# EAGLE design CNC-MainStepInterface-panel (EAGLE 6.4)
CNC Control Panel - Main + Stepper + Interface Version 1.0 (20121119) Acts as the brain for the whole system Connects to other boards via "slots" in the form of JBUS connectors which carry SPI, system clock and one interrupt line Runs the upload interface via serial to USB-CDC-ACM adapter plugged into console port One dedicated MCU per axis running all the physics for each movement Also reads the limit switches Can do linear or circular movement Can buffer the next move while the current one is executing Can halt movement in progress Passthrough topology (external LPT master support) Crossbar switch using buffers MCU as crossbar switch controller Charge pump detection/generation E-Stop detection LED control for current master UI
Assembly variants: ProMini, 20MHz
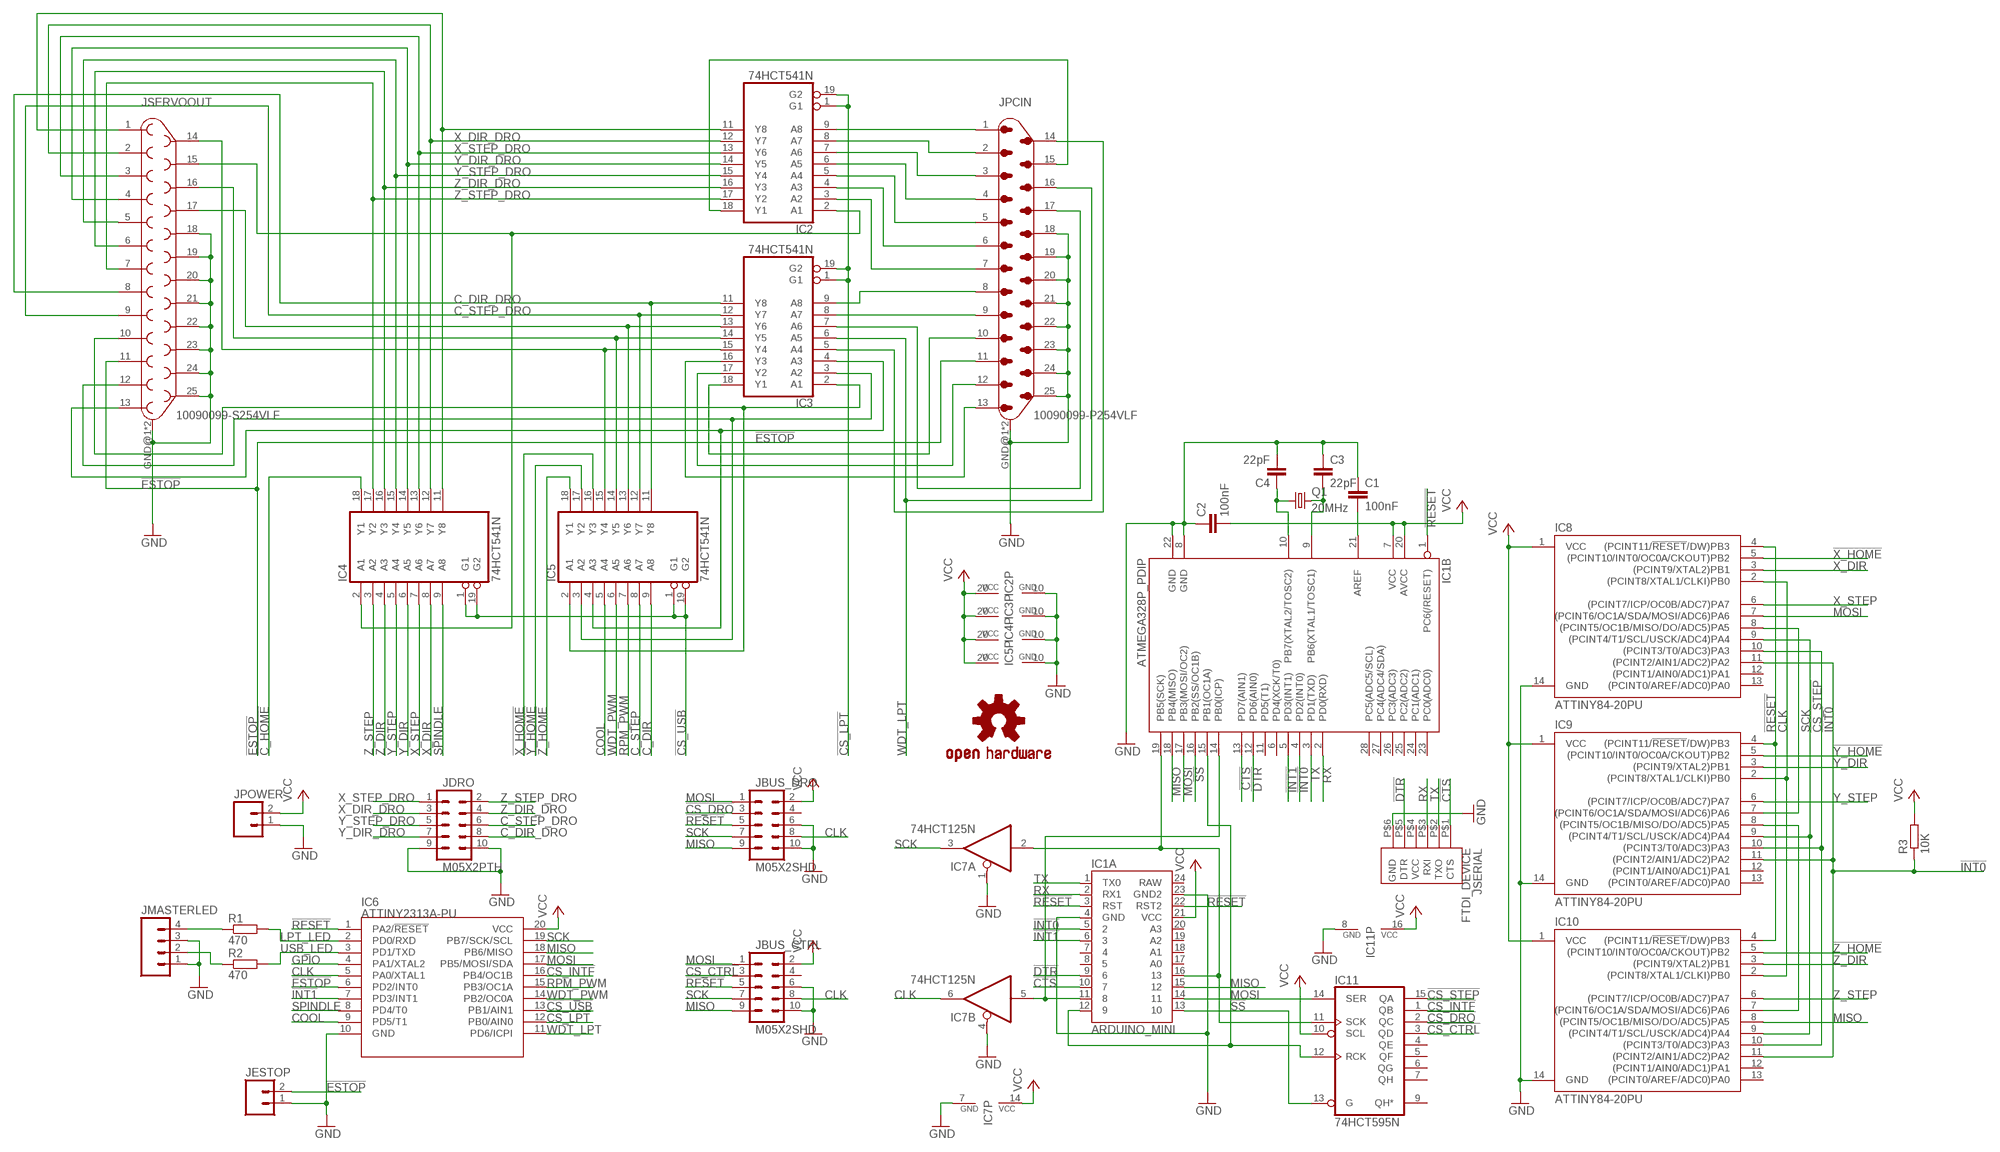
[diagram p0: schematic, sheet 1]

## Parts
C1  100nF  C-EU050-025X075  [C050-025X075]  (not fitted in variant ProMini)
C2  100nF  C-EU050-025X075  [C050-025X075]  (not fitted in variant ProMini)
C3  22pF  C-EU050-025X075  [C050-025X075]  (not fitted in variant ProMini)
C4  22pF  C-EU050-025X075  [C050-025X075]  (not fitted in variant ProMini)
IC1A  ARDUINO_MINI  [ARDUINO_MINI]  (not fitted in variant 20MHz)
IC1B  ATMEGA328P_PDIP  [DIL28-3]  (not fitted in variant ProMini)
IC2  74HCT541N  [DIL20]
IC3  74HCT541N  [DIL20]
IC4  74HCT541N  [DIL20]
IC5  74HCT541N  [DIL20]
IC6  ATTINY2313A-PU  [DIL20]
IC7  74HCT125N  [DIL14]
IC8  ATTINY84-20PU  [DIL14]
IC9  ATTINY84-20PU  [DIL14]
IC10  ATTINY84-20PU  [DIL14]
IC11  74HCT595N  [DIL16]
JBUS_CTRL  M05X2SHD  [2X5-SHROUDED]
JBUS_DRO  M05X2SHD  [2X5-SHROUDED]
JDRO  M05X2PTH  [AVR_ICSP]
JESTOP  M02PTH  [1X02]
JMASTERLED  M04PTH  [1X04]
JPCIN  10090099-P254VLF  [10090099-P254VLF]
JPOWER  M02POLAR  [MOLEX-1X2]
JSERIAL  FTDI_DEVICE  [FTDI_DEVICE_SIDE]
JSERVOOUT  10090099-S254VLF  [10090099-S254VLF]
Q1  20MHz  CRYSTALHC49U-V  [HC49U-V]  (not fitted in variant ProMini)
R1  470  R-EU_0207/10  [0207/10]
R2  470  R-EU_0207/10  [0207/10]
R3  10K  R-EU_0207/10  [0207/10]
U$1  SPARKFUN_OSHW-LOGOL  [SPARKFUN_OSHW-LOGO-L]

## Nets
!C_HOME: IC4.18(Y1)
!CS_CTRL: IC11.3(QD) JBUS_CTRL.3
!CS_DRO: IC11.2(QC) JBUS_DRO.3
!CS_INTF: IC6.16(PB4/OC1B) IC11.1(QB)
!CS_LPT: IC2.1(G1) IC2.19(G2) IC3.1(G1) IC3.19(G2) IC6.12(PB0/AIN0)
!CS_STEP: IC8.10((PCINT3/T0/ADC3)PA3) IC9.10((PCINT3/T0/ADC3)PA3) IC10.10((PCINT3/T0/ADC3)PA3) IC11.15(QA)
!CS_USB: IC4.1(G1) IC4.19(G2) IC5.1(G1) IC5.19(G2) IC6.13(PB1/AIN1)
!CTS: IC1A.10 IC1B.13(PD7(AIN1)) JSERIAL.P$1(CTS)
!DTR: IC1A.9 IC1B.12(PD6(AIN0)) JSERIAL.P$5(DTR)
!ESTOP: IC6.6(PD2/INT0) JESTOP.2 JPCIN.11 JSERVOOUT.11
!INT0: IC1A.5 IC1B.4(PD2(INT0)) IC8.11((PCINT2/AIN1/ADC2)PA2) IC9.11((PCINT2/AIN1/ADC2)PA2) IC10.11((PCINT2/AIN1/ADC2)PA2) R3.1
!INT1: IC1A.6 IC1B.5(PD3(INT1)) IC6.7(PD3/INT1)
!RESET: IC1A.3(RST) IC1A.22(RST2) IC1B.1(PC6(/RESET)) IC6.1(PA2/!RESET) IC8.4((PCINT11/!RESET!/DW)PB3) IC9.4((PCINT11/!RESET!/DW)PB3) IC10.4((PCINT11/!RESET!/DW)PB3) JBUS_CTRL.5 JBUS_DRO.5
!SS: IC1A.13 IC1B.16(PB2(SS/OC1B)) IC11.13(G)
!X_HOME: IC5.16(Y3) IC8.5((PCINT10/INT0/OC0A/CKOUT)PB2)
!Y_HOME: IC5.17(Y2) IC9.5((PCINT10/INT0/OC0A/CKOUT)PB2)
!Z_HOME: IC5.18(Y1) IC10.5((PCINT10/INT0/OC0A/CKOUT)PB2)
C_DIR: IC5.9(A8)
C_DIR_DRO: IC3.11(Y8) IC5.11(Y8) JDRO.8 JSERVOOUT.8
C_STEP: IC5.8(A7)
C_STEP_DRO: IC3.12(Y7) IC5.12(Y7) JDRO.6 JSERVOOUT.9
CLK: IC6.5(PA0/XTAL1) IC7.6(B:O) IC8.2((PCINT8/XTAL1/CLKI)PB0) IC9.2((PCINT8/XTAL1/CLKI)PB0) IC10.2((PCINT8/XTAL1/CLKI)PB0) JBUS_CTRL.8 JBUS_DRO.8
CLK_INT: IC1A.11 IC1B.14(PB0(ICP)) IC7.5(B:I)
COOL: IC5.5(A4) IC6.9(PD5/T1)
GND: C1.1 C2.1 C3.1 C4.2 IC1A.4(GND) IC1A.23(GND2) IC1B.8(GND) IC1B.22(GND) IC2.10(GND) IC3.10(GND) IC4.10(GND) IC5.10(GND) IC6.10(GND) IC7.1(A:OE) IC7.4(B:OE) IC7.7(P:GND) IC8.14(GND) IC9.14(GND) IC10.14(GND) IC11.8(GND) JBUS_CTRL.6 JBUS_CTRL.10 JBUS_DRO.6 JBUS_DRO.10 JDRO.9 JDRO.10 JESTOP.1 JMASTERLED.1 JMASTERLED.3 JPCIN.18 JPCIN.19 JPCIN.20 JPCIN.21 JPCIN.22 JPCIN.23 JPCIN.24 JPCIN.25 JPCIN.GND@1(GND) JPCIN.GND@2(GND) JPOWER.1 JSERIAL.P$6(GND) JSERVOOUT.18 JSERVOOUT.19 JSERVOOUT.20 JSERVOOUT.21 JSERVOOUT.22 JSERVOOUT.23 JSERVOOUT.24 JSERVOOUT.25 JSERVOOUT.GND@1(GND) JSERVOOUT.GND@2(GND)
GPIO: IC6.4(PA1/XTAL2)
LPT_LED: IC6.2(PD0/RXD) R1.2
MISO: IC1A.15 IC1B.18(PB4(MISO)) IC6.18(PB6/MISO) IC10.8((PCINT5/OC1B/MISO/DO/ADC5)PA5) JBUS_CTRL.9 JBUS_DRO.9
MISO_1: IC8.8((PCINT5/OC1B/MISO/DO/ADC5)PA5) IC9.7((PCINT6/OC1A/SDA/MOSI/ADC6)PA6)
MISO_2: IC9.8((PCINT5/OC1B/MISO/DO/ADC5)PA5) IC10.7((PCINT6/OC1A/SDA/MOSI/ADC6)PA6)
MOSI: IC1A.14 IC1B.17(PB3(MOSI/OC2)) IC6.17(PB5/MOSI/SDA) IC8.7((PCINT6/OC1A/SDA/MOSI/ADC6)PA6) IC11.14(SER) JBUS_CTRL.1 JBUS_DRO.1
N$1: IC2.9(A8) JPCIN.1
N$2: IC2.8(A7) JPCIN.2
N$3: IC2.7(A6) JPCIN.3
N$4: IC2.6(A5) JPCIN.4
N$5: IC2.5(A4) JPCIN.5
N$6: IC2.4(A3) JPCIN.6
N$7: IC2.3(A2) JPCIN.7
N$8: IC3.9(A8) JPCIN.8
N$9: IC3.8(A7) JPCIN.9
N$10: IC3.5(A4) JPCIN.14
N$11: JMASTERLED.2 R2.1
N$12: IC3.2(A1) IC5.2(A1) JSERVOOUT.10
N$13: IC3.3(A2) IC5.3(A2) JSERVOOUT.12
N$14: IC3.7(A6) JPCIN.17
N$15: IC3.4(A3) IC5.4(A3) JSERVOOUT.13
N$16: JMASTERLED.4 R1.1
N$17: IC3.16(Y3) JPCIN.13
N$18: IC3.17(Y2) JPCIN.12
N$19: IC2.18(Y1) JPCIN.15
N$20: C1.2 IC1B.21(AREF)
N$21: IC3.18(Y1) JPCIN.10
N$22: IC3.15(Y4) IC5.15(Y4) JSERVOOUT.14
N$23: IC3.14(Y5) IC5.14(Y5) JSERVOOUT.16
N$24: IC3.13(Y6) IC5.13(Y6) JSERVOOUT.17
N$34: IC2.2(A1) IC4.2(A1) JSERVOOUT.15
N$38: IC2.11(Y8) IC4.11(Y8) JSERVOOUT.1
RPM_PWM: IC5.7(A6) IC6.15(PB3/OC1A)
RX: IC1A.2(RX1) IC1B.2(PD0(RXD)) JSERIAL.P$3(RXI)
SADDR: IC1A.12 IC1B.15(PB1(OC1A)) IC11.12(RCK)
SCK: IC6.19(PB7/SCK/SCL) IC7.3(A:O) IC8.9((PCINT4/T1/SCL/USCK/ADC4)PA4) IC9.9((PCINT4/T1/SCL/USCK/ADC4)PA4) IC10.9((PCINT4/T1/SCL/USCK/ADC4)PA4) JBUS_CTRL.7 JBUS_DRO.7
SCK_INT: IC1A.16 IC1B.19(PB5(SCK)) IC7.2(A:I) IC11.11(SCK)
SPINDLE: IC4.9(A8) IC6.8(PD4/T0)
TX: IC1A.1(TX0) IC1B.3(PD1(TXD)) JSERIAL.P$2(TXO)
USB_LED: IC6.3(PD1/TXD) R2.2
VCC: C2.2 IC1A.21(VCC) IC1B.7(VCC) IC1B.20(AVCC) IC2.20(VCC) IC3.20(VCC) IC4.20(VCC) IC5.20(VCC) IC6.20(VCC) IC7.14(P:VCC) IC8.1(VCC) IC9.1(VCC) IC10.1(VCC) IC11.10(SCL) IC11.16(VCC) JBUS_CTRL.2 JBUS_DRO.2 JPOWER.2 R3.2
WDT_LPT: IC3.6(A5) IC6.11(PD6/ICPI) JPCIN.16
WDT_PWM: IC5.6(A5) IC6.14(PB2/OC0A)
X_DIR: IC4.8(A7) IC8.3((PCINT9/XTAL2)PB1)
X_DIR_DRO: IC2.12(Y7) IC4.12(Y7) JDRO.3 JSERVOOUT.2
X_STEP: IC4.7(A6) IC8.6((PCINT7/ICP/OC0B/ADC7)PA7)
X_STEP_DRO: IC2.13(Y6) IC4.13(Y6) JDRO.1 JSERVOOUT.3
XTAL1: C4.1 IC1B.10(PB7(XTAL2/TOSC2)) Q1.1
XTAL2: C3.2 IC1B.9(PB6(XTAL1/TOSC1)) Q1.2
Y_DIR: IC4.6(A5) IC9.3((PCINT9/XTAL2)PB1)
Y_DIR_DRO: IC2.14(Y5) IC4.14(Y5) JDRO.7 JSERVOOUT.4
Y_STEP: IC4.5(A4) IC9.6((PCINT7/ICP/OC0B/ADC7)PA7)
Y_STEP_DRO: IC2.15(Y4) IC4.15(Y4) JDRO.5 JSERVOOUT.5
Z_DIR: IC4.4(A3) IC10.3((PCINT9/XTAL2)PB1)
Z_DIR_DRO: IC2.16(Y3) IC4.16(Y3) JDRO.4 JSERVOOUT.6
Z_STEP: IC4.3(A2) IC10.6((PCINT7/ICP/OC0B/ADC7)PA7)
Z_STEP_DRO: IC2.17(Y2) IC4.17(Y2) JDRO.2 JSERVOOUT.7
Unconnected: IC1A.7 IC1A.8 IC1A.17(A0) IC1A.18(A1) IC1A.19(A2) IC1A.20(A3) IC1A.24(RAW) IC1B.6(PD4(XCK/T0)) IC1B.11(PD5(T1)) IC1B.23(PC0(ADC0)) IC1B.24(PC1(ADC1)) IC1B.25(PC2(ADC2)) IC1B.26(PC3(ADC3)) IC1B.27(PC4(ADC4/SDA)) IC1B.28(PC5(ADC5/SCL)) IC7.8(C:O) IC7.9(C:I) IC7.10(C:OE) IC7.11(D:O) IC7.12(D:I) IC7.13(D:OE) IC8.12((PCINT1/AIN0/ADC1)PA1) IC8.13((PCINT0/AREF/ADC0)PA0) IC9.12((PCINT1/AIN0/ADC1)PA1) IC9.13((PCINT0/AREF/ADC0)PA0) IC10.12((PCINT1/AIN0/ADC1)PA1) IC10.13((PCINT0/AREF/ADC0)PA0) IC11.4(QE) IC11.5(QF) IC11.6(QG) IC11.7(QH) IC11.9(QH*) JBUS_CTRL.4 JBUS_DRO.4 JSERIAL.P$4(VCC)

## Library data of the parts
C1-C4 = rcl:C-EU: CAPACITOR, European symbol
IC1A = SparkFun-Boards-mine:ARDUINO_MINI: Arduino Pro Mini footprint
IC1B = SparkFun-DigitalIC:ATMEGA328P_PDIP: uC used in the Arduino 32kb flash, 1k EEPROM, 2k SRAM This is the through-hole version of this chip.
IC2-IC5 = 74xx-eu:74*541: Octal BUFFER and LINE DRIVER, 3-state
IC6 = SparkFun-DigitalIC-mine:ATTINY2313A: Atmel ATtiny2313A 2KiB Flash, 128 Bytes SRAM, 128 Bytes EEPROM 18 GPIO, USART, USI, picoPower DIP and SOIC packages provided
IC7 = 74xx-eu:74*125: Quad bus BUFFER, 3-state
IC8-IC10 = SparkFun-DigitalIC-mine:ATTINY84: Atmel 14-pin 2/4/8kB flash uC
IC11 = 74xx-eu:74*595: 8-bit SHIFT REGISTER, output latch
JBUS_CTRL JBUS_DRO JDRO = SparkFun-Connectors:M05X2: Header 5x2 Standard 10-pin dual row 0.1" header. Commonly used with AVR-ISP. Use with Spark Fun Electronics SKU: PRT-00778
JESTOP JPOWER = SparkFun-Connectors:M02: Header 2 Standard 2-pin 0.1" header. Use with straight break away headers (SKU : PRT-00116), right angle break away headers (PRT-00553), swiss pins (PRT-00743), machine pins (PRT-00117), and female headers (PRT-00115). Molex polarized connector foot print use with SKU : PRT-08233 with associated crimp pins and housings.
JMASTERLED = SparkFun-Connectors:M04: Header 4 Standard 4-pin 0.1" header. Use with straight break away headers (SKU : PRT-00116), right angle break away headers (PRT-00553), swiss pins (PRT-00743), machine pins (PRT-00117), and female headers (PRT-00115). Molex polarized connector foot print use with SKU : PRT-08231 with associated crimp pins and housings. 1MM SMD Version SKU: PRT-10208
JPCIN = radu-collected:10090099-P254VLF: FCI 10090099-P254[VLX]LF DB-25 male connector, right angle PCB mount
JSERIAL = SparkFun-Connectors:FTDI_DEVICE: Connector which mates to FTDI basic or FTDI cable.
JSERVOOUT = radu-collected:10090099-S254VLF: FCI 10090099-S254[VLX]LF DB-25 female connector, right angle PCB mount
Q1 = crystal:CRYSTAL: CRYSTAL; OC_FARNELL: 1666969; OC_NEWARK: unknown
R1-R3 = rcl:R-EU_: RESISTOR, European symbol
U$1 = Si4735_Breakout-v10:SPARKFUN_OSHW-LOGO: Open Source Hardware Logo This logo indicates the piece of hardware it is found on incorporates a OSHW license and/or adheres to the definition of open source hardware found here: http://freedomdefined.org/OSHW

## Board
CNC Control Panel - Main + Step + Interface Version 1.0 (20121119) This version was the first to be manufactured at TinyOSShop, silkscreen reads "20121119" Routing was done in FreeRouting via .DSN, the result imported back via .SCR and manually adjusted to match DRU
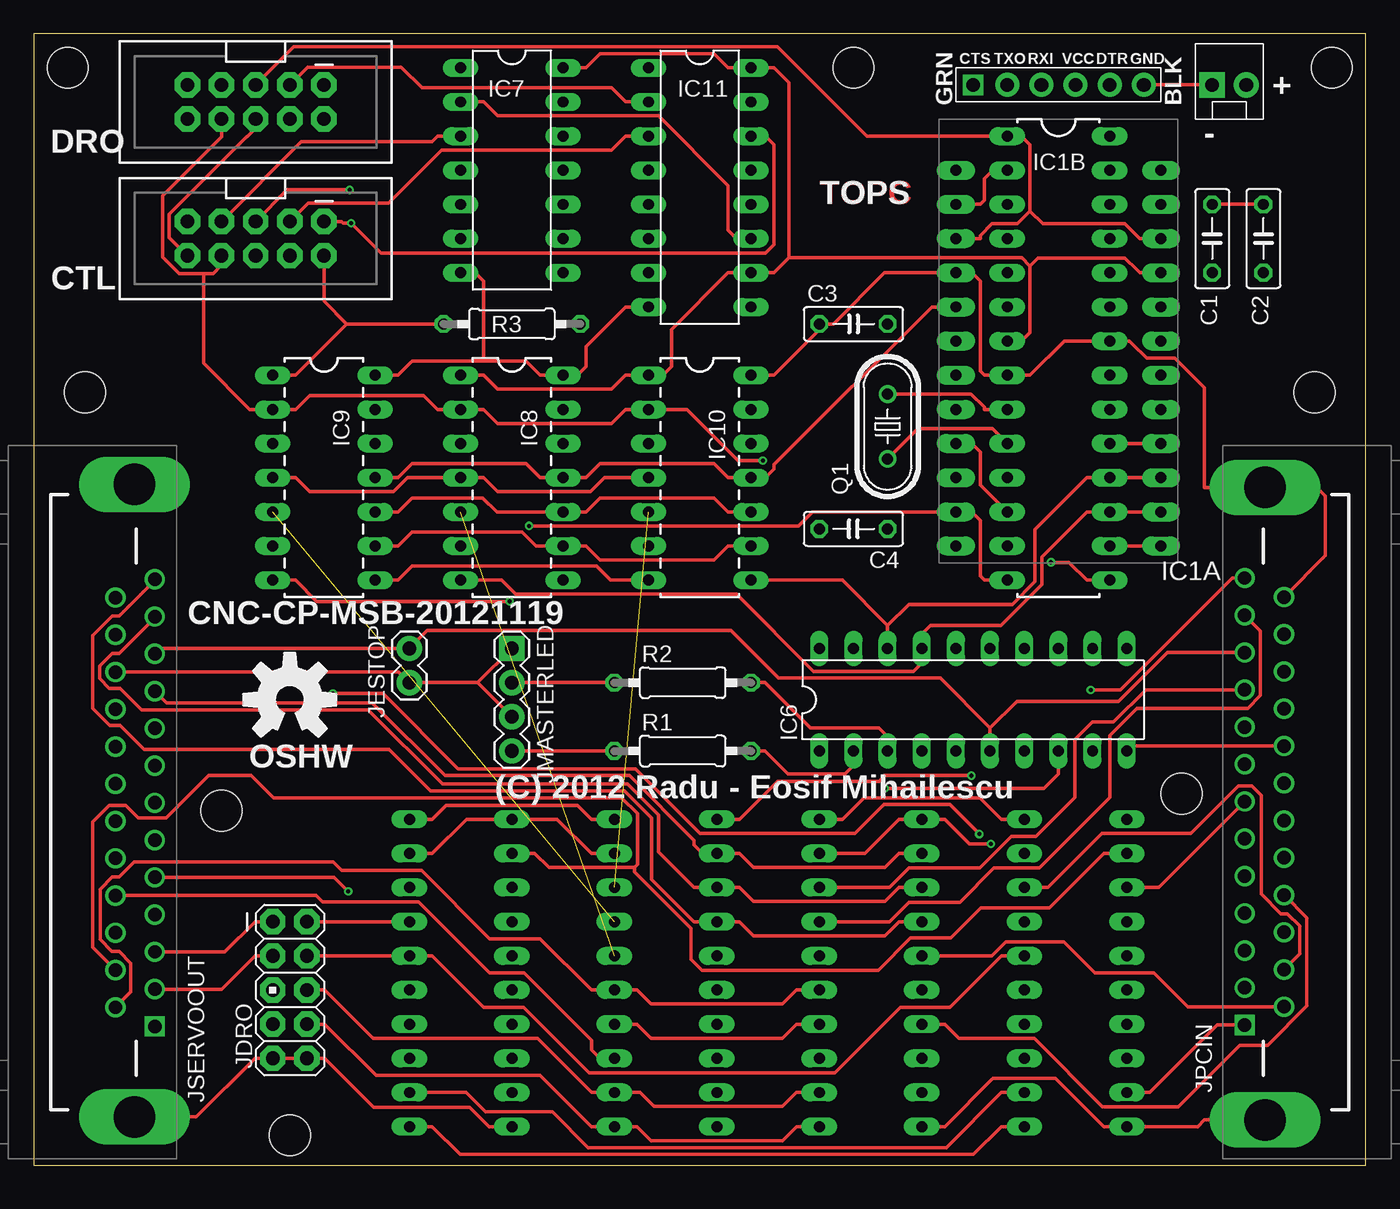
[diagram p1: board, top side]
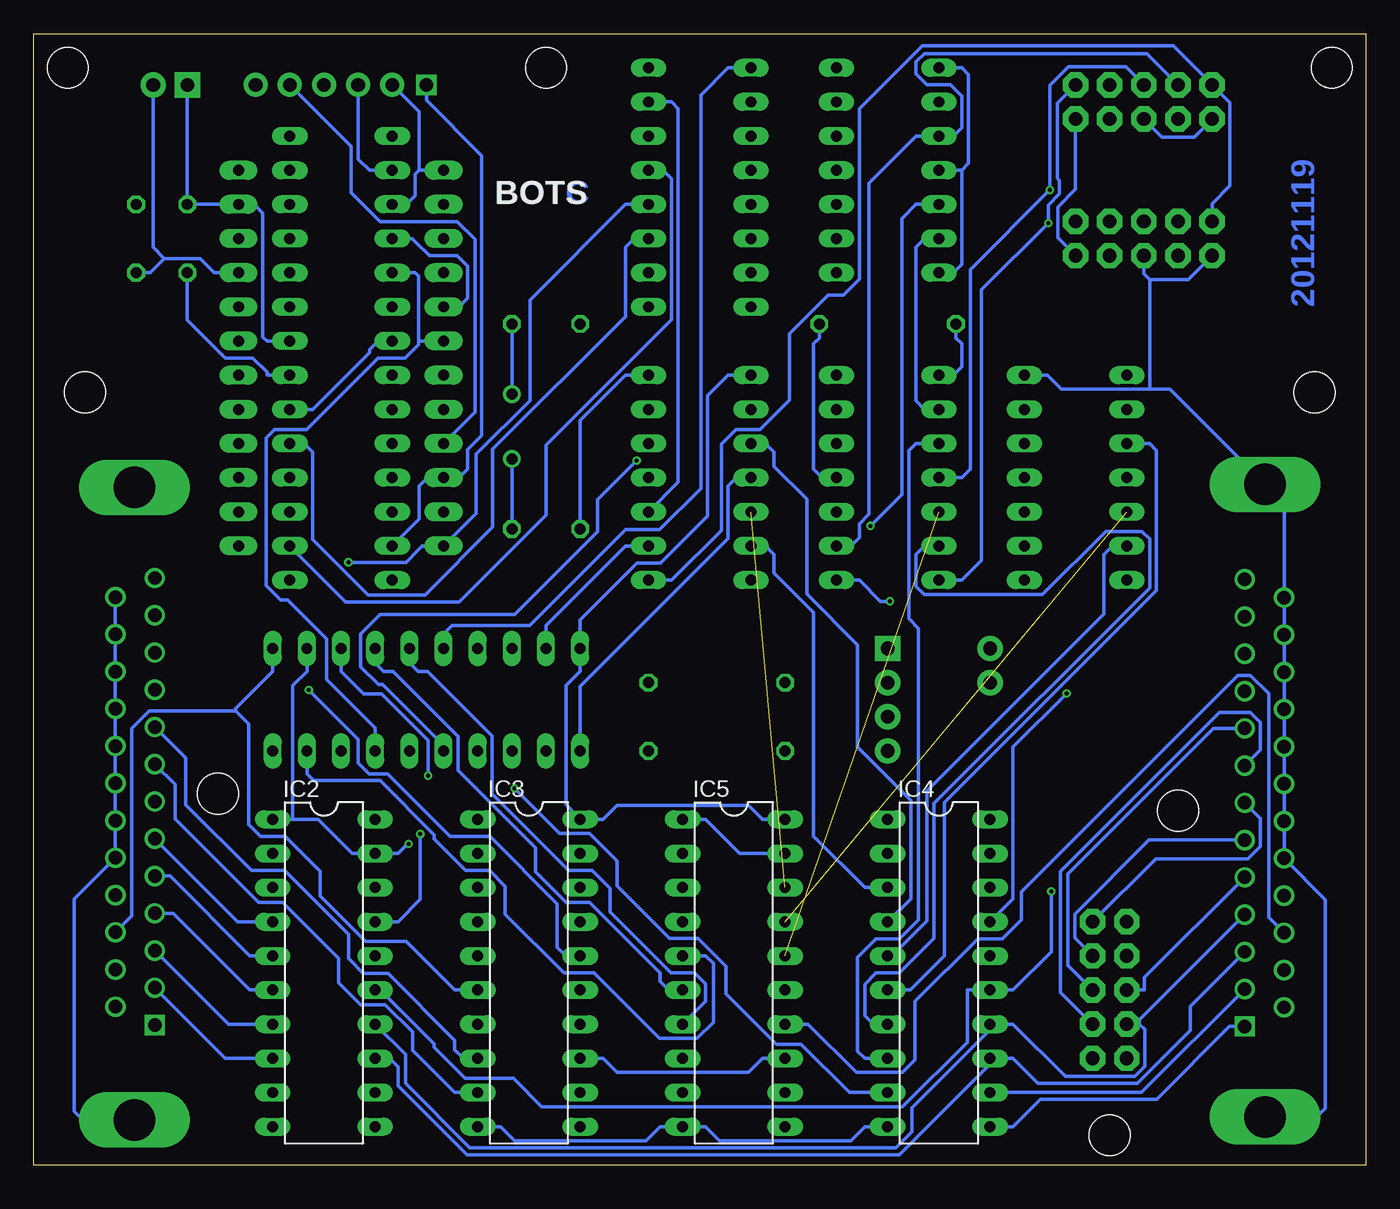
[diagram p2: board, bottom side, seen from below]

Size 99.06 x 84.14 mm. Coordinates in mm from the lower left corner, seen from the top.
Outline: 0,0 99.06,0 99.06,84.14 0,84.14 0,0
Copper layers (1*16): Top 0.035mm / dielectric 1.5mm / Bottom 0.035mm
Design rules "ITEADstudio_DRC": minimum track width 10mil, minimum drill 12mil, track to track 10mil, track to pad 10mil, pad to pad 10mil, via to via 10mil, smd to smd 0mil, copper to edge 20mil, drill to drill 10mil, minimum pad ring 10mil, minimum via ring 6mil, stop-mask expansion 4mil, vias tented up to drill 100mil, thermal gap 10mil
Holes 3.05 mm at 3.81,57.47 95.25,57.47 19.05,2.22 2.54,81.6 96.52,81.6 60.96,81.6 13.97,26.35 85.34,27.62

### Footprints (pad centres in the part's own frame; a part is rotated, then mirrored left to right if it is on the bottom)
C050-025X075 = drill 0.813 octagon: 1 -2.54,0; 2 2.54,0
ARDUINO_MINI = drill 0.813 pad 1.422 long: 1 -7.62,12.7; 2 -7.62,10.16; 3 -7.62,7.62; 4 -7.62,5.08; 5 -7.62,2.54; 6 -7.62,0; 7 -7.62,-2.54; 8 -7.62,-5.08; 9 -7.62,-7.62; 10 -7.62,-10.16; 11 -7.62,-12.7; 12 -7.62,-15.24; 13 7.62,-15.24; 14 7.62,-12.7; 15 7.62,-10.16; 16 7.62,-7.62; 17 7.62,-5.08; 18 7.62,-2.54; 19 7.62,0; 20 7.62,2.54; 21 7.62,5.08; 22 7.62,7.62; 23 7.62,10.16; 24 7.62,12.7
DIL28-3 = drill 0.813 long: 1 -16.51,-3.81; 2 -13.97,-3.81; 3 -11.43,-3.81; 4 -8.89,-3.81; 5 -6.35,-3.81; 6 -3.81,-3.81; 7 -1.27,-3.81; 8 1.27,-3.81; 9 3.81,-3.81; 10 6.35,-3.81; 11 8.89,-3.81; 12 11.43,-3.81; 13 13.97,-3.81; 14 16.51,-3.81; 15 16.51,3.81; 16 13.97,3.81; 17 11.43,3.81; 18 8.89,3.81; 19 6.35,3.81; 20 3.81,3.81; 21 1.27,3.81; 22 -1.27,3.81; 23 -3.81,3.81; 24 -6.35,3.81; 25 -8.89,3.81; 26 -11.43,3.81; 27 -13.97,3.81; 28 -16.51,3.81
DIL20 = drill 0.813 long: 1 -11.43,-3.81; 2 -8.89,-3.81; 3 -6.35,-3.81; 4 -3.81,-3.81; 5 -1.27,-3.81; 6 1.27,-3.81; 7 3.81,-3.81; 8 6.35,-3.81; 9 8.89,-3.81; 10 11.43,-3.81; 11 11.43,3.81; 12 8.89,3.81; 13 6.35,3.81; 14 3.81,3.81; 15 1.27,3.81; 16 -1.27,3.81; 17 -3.81,3.81; 18 -6.35,3.81; 19 -8.89,3.81; 20 -11.43,3.81
DIL14 = drill 0.813 long: 1 -7.62,-3.81; 2 -5.08,-3.81; 3 -2.54,-3.81; 4 0,-3.81; 5 2.54,-3.81; 6 5.08,-3.81; 7 7.62,-3.81; 8 7.62,3.81; 9 5.08,3.81; 10 2.54,3.81; 11 0,3.81; 12 -2.54,3.81; 13 -5.08,3.81; 14 -7.62,3.81
DIL14' = drill 0.813 long: 1 -8.89,-3.81; 2 -6.35,-3.81; 3 -3.81,-3.81; 4 -1.27,-3.81; 5 1.27,-3.81; 6 3.81,-3.81; 7 6.35,-3.81; 8 6.35,3.81; 9 3.81,3.81; 10 1.27,3.81; 11 -1.27,3.81; 12 -3.81,3.81; 13 -6.35,3.81; 14 -8.89,3.81
DIL16 = drill 0.813 long: 1 -8.89,-3.81; 2 -6.35,-3.81; 3 -3.81,-3.81; 4 -1.27,-3.81; 5 1.27,-3.81; 6 3.81,-3.81; 7 6.35,-3.81; 8 8.89,-3.81; 9 8.89,3.81; 10 6.35,3.81; 11 3.81,3.81; 12 1.27,3.81; 13 -1.27,3.81; 14 -3.81,3.81; 15 -6.35,3.81; 16 -8.89,3.81
2X5-SHROUDED = drill 1.016 pad 1.88 octagon: 1 -1.27,5.08; 2 1.27,5.08; 3 -1.27,2.54; 4 1.27,2.54; 5 -1.27,0; 6 1.27,0; 7 -1.27,-2.54; 8 1.27,-2.54; 9 -1.27,-5.08; 10 1.27,-5.08
AVR_ICSP = drill 1.016 pad 1.88 octagon: 1 -1.27,5.08; 2 1.27,5.08; 3 -1.27,2.54; 4 1.27,2.54; 5 -1.27,0; 6 1.27,0; 7 -1.27,-2.54; 8 1.27,-2.54; 9 -1.27,-5.08; 10 1.27,-5.08
1X02 = drill 1.016 pad 1.88: 1 0,0; 2 2.54,0
1X04 = drill 1.016 pad 1.88 square: 1 0,0 | drill 1.016 pad 1.88: 2 2.54,0; 3 5.08,0; 4 7.62,0
10090099-P254VLF = drill 1 square: 1 -1.39,-16.57 | drill 1: 2 -1.39,-13.8; 3 -1.39,-11.03; 4 -1.39,-8.26; 5 -1.39,-5.49; 6 -1.39,-2.72; 7 -1.39,0.05; 8 -1.39,2.82; 9 -1.39,5.59; 10 -1.39,8.36; 11 -1.39,11.13; 12 -1.39,13.9; 13 -1.39,16.67; 14 1.545,-15.215; 15 1.545,-12.445; 16 1.545,-9.675; 17 1.545,-6.905; 18 1.545,-4.135; 19 1.545,-1.365; 20 1.545,1.405; 21 1.545,4.175; 22 1.545,6.945; 23 1.545,9.715; 24 1.545,12.485; 25 1.545,15.255 | drill 3.1 long: GND@1 0.12,23.41; GND@2 0.12,-23.63
MOLEX-1X2 = drill 1.016 pad 1.88 square: 1 0,0 | drill 1.016 pad 1.88: 2 2.54,0
FTDI_DEVICE_SIDE = drill 1 square: P$1 -6.35,0 | drill 1.016 pad 1.778: P$2 -3.81,0; P$3 -1.27,0; P$4 1.27,0; P$5 3.81,0; P$6 6.35,0
10090099-S254VLF = drill 1 square: 1 -1.39,16.67 | drill 1: 2 -1.39,13.9; 3 -1.39,11.13; 4 -1.39,8.36; 5 -1.39,5.59; 6 -1.39,2.82; 7 -1.39,0.05; 8 -1.39,-2.72; 9 -1.39,-5.49; 10 -1.39,-8.26; 11 -1.39,-11.03; 12 -1.39,-13.8; 13 -1.39,-16.57; 14 1.545,15.255; 15 1.545,12.485; 16 1.545,9.715; 17 1.545,6.945; 18 1.545,4.175; 19 1.545,1.405; 20 1.545,-1.365; 21 1.545,-4.135; 22 1.545,-6.905; 23 1.545,-9.675; 24 1.545,-12.445; 25 1.545,-15.215 | drill 3.1 long: GND@1 0.12,23.41; GND@2 0.12,-23.63
HC49U-V = drill 0.813: 1 -2.413,0; 2 2.413,0
0207/10 = drill 0.813 octagon: 1 -5.08,0; 2 5.08,0

### Placement (x,y rotation side)
C1  87.63,68.9 270 top
C2  91.44,68.9 270 top
C3  60.96,62.55 0 top
C4  60.96,47.31 180 top
IC1A  76.2,61.28 0 top
IC1B  76.2,60.01 270 top
IC2  77.47,14.29 270 bottom
IC3  62.23,14.29 270 bottom
IC4  31.75,14.29 270 bottom
IC5  46.99,14.29 270 bottom
IC6  69.85,34.61 0 top
IC7  35.56,73.98 270 top
IC8  ATTINY84-20PU  [DIL14']  35.56,49.85 270 top
IC9  ATTINY84-20PU  [DIL14']  21.59,49.85 270 top
IC10  ATTINY84-20PU  [DIL14']  49.53,49.85 270 top
IC11  49.53,72.71 270 top
JBUS_CTRL  16.51,68.9 270 top
JBUS_DRO  16.51,79.06 270 top
JDRO  19.05,13.02 0 top
JESTOP  27.94,35.88 90 top
JMASTERLED  35.56,38.42 270 top
JPCIN  91.44,26.99 0 top
JPOWER  87.63,80.33 0 top
JSERIAL  76.2,80.33 0 top
JSERVOOUT  7.62,26.99 180 top
Q1  63.5,54.93 90 top
R1  48.26,30.8 0 top
R2  48.26,35.88 0 top
R3  35.56,62.55 180 top
U$1  19.05,34.61 0 top

### Tracks (layer width: path | path; a pad name or v marks a point on that pad's centre or on a via)
!CS_CTRL
  Top 0.254: IC11.3 44.02,76.52 42.98,75.48 30.33,75.48 26.38,71.52 20.41,71.52 JBUS_CTRL.3
!CS_DRO
  Top 0.254: IC11.2 44.02,79.06 42.98,80.1 28.9,80.1 27.34,81.66 20.38,81.66 JBUS_DRO.3
!CS_INTF
  Bottom 0.254: IC6.16 68.58,39.48 67.94,40.12 62.19,40.12 55.04,47.27 52.5,47.27 49.45,50.32 49.45,79.56 47.42,81.6 IC11.1
!CS_LPT  (via drill 0.3 pad 0.61)
  Top 0.254: v71.17,23.89 69.56,23.89 67.74,25.72 IC3.1 64.34,25.72 61.8,23.18 60.12,23.18 IC3.19
  Bottom 0.254: v71.17,23.89 71.24,23.89 71.96,23.18 IC2.19 74.51,23.18 75.36,23.18 77.9,25.72 79.81,25.72 | 79.81,25.72 80.43,25.72 IC2.1 | 79.81,25.72 79.81,35.65 78.74,36.72 IC6.12
!CS_STEP
  Top 0.254: IC9.10 27.1,48.58 28.14,49.62 33.4,49.62 34.44,48.58 IC8.10 41.07,48.58 42.11,49.62 50.6,49.62 51.64,48.58 IC10.10
  Bottom 0.254: IC10.10 51.13,50.79 51.13,78.55 51.64,79.06 IC11.15
!CS_USB  (via drill 0.3 pad 0.61)
  Top 0.254: v69.73,28.96 63.28,28.96 62.84,28.52 55.31,28.52 52.5,25.72 IC5.1 | IC4.19 29.64,23.18 32.18,25.72 IC4.1 38.94,25.72 41.48,23.18 IC5.19
  Bottom 0.254: IC5.1 49.1,25.72 46.56,23.18 IC5.19 | v69.73,28.96 69.73,31.59 73.18,35.04 74.52,35.04 76.2,36.72 IC6.13
!CTS
  Bottom 0.254: JSERIAL.P$1 69.85,79.19 65.73,75.08 65.73,54.25 66.78,53.2 66.78,51.75 67.41,51.12 IC1A.10 69.75,51.12 70.38,50.48 70.38,48.04 IC1B.13
!DTR
  Top 0.254: IC1A.9 69.75,53.66 70.38,53.02 70.38,50.58 IC1B.12
  Bottom 0.254: IC1A.9 66.25,55.99 66.25,68.86 67.56,70.17 73.29,70.17 75.44,72.32 75.44,75.76 JSERIAL.P$5
!ESTOP
  Top 0.254: 71.12,32.5 73.1,34.48 80.65,34.48 84.29,38.12 JPCIN.11 | 71.12,32.5 67.41,36.21 55.38,36.21 51.85,39.74 29.26,39.74 JESTOP.2 9.41,38.42 JSERVOOUT.11 | IC6.6 71.12,32.5
!INT0
  Top 0.254: IC1A.5 66.78,63.82 55.04,52.08 55.04,51.75 54.41,51.12 IC10.11 52.96,51.12 51.64,51.12 50.6,52.16 42.11,52.16 41.07,51.12 IC8.11 37.67,51.12 36.63,52.16 28.14,52.16 27.1,51.12 IC9.11
  Bottom 0.254: IC1B.4 70.9,68.9 70.69,68.68 69.63,67.63 67.57,67.63 66.78,66.83 66.78,64.45 67.41,63.82 IC1A.5 | IC8.11 40.44,51.12 41.07,51.75 41.07,61.07 40.64,61.51 R3.1
!INT1
  Bottom 0.254: IC6.7 73.66,32.5 77.29,36.13 77.29,39.14 80.18,42.03 80.71,42.03 81.77,43.09 81.77,54.08 81.15,54.7 78.74,54.7 73.44,60.01 71.45,60.01 70.44,61.02 70.44,61.28 | 70.44,61.28 70.44,66.11 70.69,66.36 IC1B.5 | 70.44,61.28 69.48,61.28 IC1A.6
!RESET  (via drill 0.3 pad 0.61)
  Top 0.254: IC1A.22 82.24,68.9 82.02,69.12 81.15,69.99 75.04,69.99 74.09,70.94 | 74.09,70.94 73.14,69.99 71.25,69.99 70.38,69.12 70.38,68.9 IC1A.3 | 74.09,70.94 74.09,75.88 73.46,76.52 IC1B.1 61.96,76.52 55.33,83.16 19.34,83.16 JBUS_DRO.5 | IC10.4 42.45,51.12 41.41,50.08 34.49,50.08 33.45,51.12 IC8.4 27.82,51.12 26.78,50.08 20.52,50.08 19.48,51.12 IC9.4 | v23.5,72.52 18.86,72.52 JBUS_CTRL.5
  Bottom 0.254: JBUS_DRO.5 17.86,81.68 22.12,81.68 23.5,80.3 v23.5,72.52 29.42,66.59 29.42,51.74 30.05,51.12 IC8.4 | IC6.1 58.42,35.59 47.42,46.59 47.42,50.48 46.79,51.12 IC10.4
!SS
  Top 0.254: IC1B.16 IC1A.13
  Bottom 0.254: IC1B.16 75.86,41.89 67.42,41.89 60.96,48.35 60.96,53.54 51.64,62.86 51.64,73.34 52.27,73.98 IC11.13
!X_HOME  (1 unrouted)
!Y_HOME  (1 unrouted)
!Z_HOME  (1 unrouted)
C_DIR_DRO
  Top 0.254: JDRO.8 21.64,10.48 25.45,6.67 37.67,6.67 41.48,2.86 IC5.11 44.88,2.86 45.92,1.82 55.68,1.82 56.72,2.86 IC3.11
  Bottom 0.254: JDRO.8 22.71,12.86 22.71,21.85 10.89,33.66 8.59,33.66 7.84,32.92 7.84,30.88 JSERVOOUT.8
C_STEP_DRO
  Top 0.254: JDRO.6 21.64,13.02 25.24,9.42 37.45,9.42 41.48,5.4 IC5.12 43.42,5.4 44.88,5.4 45.1,5.4 46.14,4.36 55.68,4.36 56.72,5.4 IC3.12
  Bottom 0.254: JDRO.6 22.16,14.86 22.16,21.67 11.35,32.48 JSERVOOUT.9
CLK  (via drill 0.3 pad 0.61)
  Top 0.254: v54.22,52.39 52.38,52.39 48.56,56.2 IC10.2 45.34,56.2 44.02,56.2 42.98,55.16 34.49,55.16 33.45,56.2 IC8.2 30.05,56.2 29.01,57.24 20.52,57.24 19.48,56.2 IC9.2 16.08,56.2 12.65,59.63 12.65,66.31 | 12.65,66.31 10.81,66.31 9.58,67.53 9.58,72.08 13.97,76.47 JBUS_DRO.8 | JBUS_CTRL.8 13.97,66.94 13.34,66.31 12.65,66.31 | 12.65,66.31
  Bottom 0.254: v54.22,52.39 57.12,49.48 57.12,47.1 63.3,40.93 73.31,40.93 74.73,39.51 74.73,37.03 73.42,35.73 73.12,35.73 68.58,31.19 IC6.5 | IC8.2 32.82,56.2 33.45,56.83 33.45,68.26 32.82,68.9 IC7.6
CLK_INT  (via drill 0.3 pad 0.61)
  Top 0.254: v36.83,47.54 56.87,47.54 57.91,48.58 IC1A.11 69.75,48.58 70.38,47.94 70.38,43.8 70.69,43.5 IC1B.14
  Bottom 0.254: v36.83,47.54 34.51,49.86 34.51,70.38 33.45,71.44 IC7.5
COOL
  Bottom 0.254: IC6.9 78.74,29.1 78.23,28.59 73.29,28.59 69.27,24.56 69.27,24.25 66.92,21.91 65.17,21.91 63.99,20.72 63.99,18.66 59.61,14.29 57.38,14.29 52.51,9.42 49.72,9.42 48.53,10.61 48.53,14.99 49.1,15.56 IC5.5
GND
  Top 0.254: JSERVOOUT.23 27.16,36.66 JESTOP.1 33.02,35.88 | C1.1 C2.1 | 33.02,35.88 JMASTERLED.3 | 33.02,35.88 JMASTERLED.1 | IC3.10 67.74,2.86 71.34,6.45 75.98,6.45 79.58,2.86 IC2.10 86.56,2.86 87.06,3.36 JPCIN.GND@2 | JPCIN.21 83.05,31.16 81.64,31.16 IC6.10 | JPCIN.25 96.06,45.31 96.06,49.76 95.42,50.4 JPCIN.GND@1 87.06,50.4 87.06,57.81 84.87,60.01 82.76,60.01 81.71,61.06 81.49,61.28 IC1B.22 76.63,61.28 74.09,58.74 IC1B.8 70.69,58.74 70.38,59.04 70.38,65.72 69.75,66.36 IC1A.4 68.26,66.36 66.78,66.36 63.27,66.36 59.46,62.55 C3.1 58.42,62.12 57.81,61.51 55.04,58.74 IC10.14 | IC7.7 32.82,66.36 33.45,65.72 33.45,59.78 | 33.45,59.78 28.14,59.78 27.1,58.74 IC9.14 | 33.45,59.78 36.63,59.78 37.67,58.74 IC8.14 40.44,58.74 41.07,59.37 41.07,60.87 44.02,63.82 IC11.8 | JBUS_DRO.6 16.51,77.1 15.88,76.47 15.85,76.47 10.09,70.71 10.09,68.97 JBUS_CTRL.10 | JSERVOOUT.GND@1 12.1,3.58 16.46,7.94 JDRO.9 JDRO.10 21.64,7.94 25.27,4.3 32.41,4.3 33.86,2.86 IC4.10 | JSERIAL.P$6 JPOWER.1
  Bottom 0.254: 16.05,65.84 16.51,66.31 JBUS_CTRL.6 | 16.05,57.7 16.05,65.84 | JBUS_CTRL.10 13.21,65.84 16.05,65.84 | 16.05,57.7 14.56,57.7 7.49,50.62 | 16.05,57.7 22.66,57.7 23.7,58.74 IC9.14 | C4.2 58.42,55.36 55.04,58.74 IC10.14 | JSERVOOUT.GND@1 3.64,3.58 3,4.21 3,19.74 JSERVOOUT.18 JSERVOOUT.19 JSERVOOUT.20 JSERVOOUT.21 JSERVOOUT.22 JSERVOOUT.23 JSERVOOUT.24 JSERVOOUT.25 6.08,49.21 7.49,50.62 | IC4.10 37.26,2.86 38.3,1.82 48.06,1.82 49.1,2.86 IC5.10 52.5,2.86 53.54,1.82 63.3,1.82 64.34,2.86 IC3.10 | JSERVOOUT.GND@2 7.49,50.62 | 30.05,73.98 29.54,74.49 29.54,81.09 30.05,81.6 IC7.1 | JPOWER.1 C1.1 85.62,71.44 IC1A.23 82.65,71.44 82.02,70.8 82.02,61.58 81.71,61.28 IC1B.22 | JPCIN.25 JPCIN.24 JPCIN.23 JPCIN.22 JPCIN.21 JPCIN.20 JPCIN.19 JPCIN.18 96.06,19.78 96.06,3.99 95.42,3.36 JPCIN.GND@2 | 30.05,73.98 30.18,73.98 IC7.4 | IC7.7 30.68,66.36 30.05,66.99 30.05,73.98 | JBUS_DRO.10 12.77,76.45 15.17,76.45 JBUS_DRO.6
LPT_LED
  Top 0.254: IC6.2 60.96,29.73 60.33,29.1 56.08,29.1 54.38,30.8 R1.2
MISO
  Top 0.254: 63.5,40.12 65.08,41.7 72.77,41.7 74.46,43.38 74.46,47.26 78.31,51.12 IC1B.18 IC1A.15 | IC10.8 60.12,43.5 63.5,40.12 | IC6.18 63.5,40.12
  Bottom 0.254: IC10.8 51.64,43.5 47.93,47.21 47.93,53.63 46.85,54.71 45.05,54.71 42.86,56.9 42.86,61.82 40,64.68 38.85,64.68 37.67,65.86 37.67,78.54 32.98,83.23 14.33,83.23 JBUS_DRO.9 10.11,79 10.11,72.81 11.43,71.49 JBUS_CTRL.9
MISO_1  (via drill 0.3 pad 0.61)
  Top 0.254: IC9.7 19.48,43.5 21.05,41.93 v35.39,41.93
  Bottom 0.254: IC8.8 37.67,43.5 36.1,41.93 v35.39,41.93
MISO_2
  Top 0.254: IC9.8 27.1,43.5 28.14,44.54 41.85,44.54 42.89,43.5 IC10.7
MOSI  (via drill 0.3 pad 0.61)
  Top 0.254: IC11.14 54.41,76.52 55.04,75.88 55.04,68.45 54.43,67.83 25.83,67.83 v23.61,70.05 23.03,70.05 22.91,70.17 JBUS_CTRL.1 | IC8.7 33.45,43.5 34.79,43.5 35.83,42.46 52.25,42.46 57.99,36.72 65.41,36.72 66.04,37.35 IC6.17 66.04,39.48 66.67,40.12 71.93,40.12 74.96,43.16 74.96,45.23 78.31,48.58 IC1B.17 IC1A.14
  Bottom 0.254: IC8.7 30.05,43.5 28.57,44.97 28.57,65.08 v23.61,70.05 23.61,71.38 22.78,72.22 22.78,73.22 22.94,73.38 22.94,78.97 JBUS_DRO.1
N$1
  Top 0.254: IC2.9 82.98,5.4 88,10.42 JPCIN.1
N$2
  Bottom 0.254: JPCIN.2 84.8,7.94 IC2.8
N$3
  Bottom 0.254: JPCIN.3 84.57,10.48 IC2.7
N$4
  Bottom 0.254: IC2.6 82.98,13.02 88.69,18.73 JPCIN.4
N$5
  Bottom 0.254: IC2.5 82.98,15.56 88.92,21.5 JPCIN.5
N$6
  Bottom 0.254: JPCIN.6 83.88,18.1 IC2.4
N$7
  Top 0.254: JPCIN.7 83.65,20.64 IC2.3
N$8
  Bottom 0.254: IC3.9 67.74,5.4 70.89,8.55 70.89,9.92 72.91,11.93 74.75,11.93 76.39,13.56 76.39,15.38 80.56,19.55 82.34,19.55 88.55,25.75 88.55,28.31 JPCIN.8
N$9
  Bottom 0.254: IC3.8 67.11,7.94 67.74,8.57 67.74,9.28 72.72,14.26 74.55,14.26 75.65,15.36 75.65,17.16 80.4,21.91 82.86,21.91 87.75,26.79 87.75,30.28 JPCIN.9
N$10
  Top 0.254: JPCIN.14 85.82,11.77 83.31,14.29 78.92,14.29 76.6,16.61 72.29,16.61 71.24,15.56 IC3.5
N$11
  Top 0.254: R2.1 JMASTERLED.2
N$12
  Top 0.254: JSERVOOUT.10 9.89,34.37 25.19,34.37 30.59,28.96 44.3,28.96 49.1,24.16 49.1,23.81 49.73,23.18 IC5.2 52.5,23.18 53.54,22.14 63.3,22.14 64.34,23.18 IC3.2
N$13
  Top 0.254: JSERVOOUT.12 9.01,40.69 6.37,38.05 5.83,38.05 4.9,37.12 4.9,36.19 5.64,35.46 6.44,35.46 8.04,33.86 24.89,33.86 30.41,28.34 44.15,28.34 46.45,26.04 46.45,23.29 49.1,20.64 IC5.3 52.5,20.64 53.54,19.6 63.3,19.6 64.34,20.64 IC3.3
N$14
  Top 0.254: IC3.7 67.74,10.48 68.78,9.44 74.4,9.44 79.48,4.36 85.12,4.36 89.69,8.92 91.75,8.92 94.67,11.84 94.67,18.39 JPCIN.17
N$15
  Top 0.254: JSERVOOUT.13 9.01,43.46 6.37,40.82 5.84,40.82 4.39,39.37 4.39,33.97 5.67,32.69 6.44,32.69 8.22,30.91 26.42,30.91 29.5,27.83 43.94,27.83 45.94,25.83 45.94,21.26 49.1,18.1 IC5.4 52.5,18.1 53.54,17.06 63.3,17.06 64.34,18.1 IC3.4
N$16
  Top 0.254: R1.1 JMASTERLED.4
N$17  (via drill 0.3 pad 0.61)
  Top 0.254: JPCIN.13 89.11,43.66 80.79,35.34 v78.6,35.34
  Bottom 0.254: IC3.16 59.49,15.56 60.12,16.19 60.12,19.44 65.13,24.45 68.08,24.45 72.73,29.1 74.1,29.1 74.93,29.92 74.93,31.67 v78.6,35.34
N$18
  Top 0.254: JPCIN.12 91.22,39.72 91.22,34.91 90.27,33.96 82.03,33.96 80.01,31.95 80.01,27.33 74.77,22.09 71.41,22.09 68.86,19.55 65.07,19.55 63.62,18.1 IC3.17
N$19
  Top 0.254: JPCIN.15 94.15,15.71 94.15,17.78 93.23,18.7 92.75,18.7 91.27,20.18 91.27,27.49 90.57,28.19 89.57,28.19 86.06,24.68 79.44,24.68 75.4,20.64 IC2.18
N$20
  Bottom 0.254: IC1B.21 81.71,58.74 81.71,58.96 82.76,60.01 84.81,60.01 87.63,62.83 C1.2
N$21
  Top 0.254: JPCIN.10 82.69,35.35 80.28,32.94 78.73,32.94 77.43,31.64 77.43,27.35 74.53,24.45 72.71,24.45 70.35,22.09 65.07,22.09 63.62,20.64 IC3.18
N$22
  Top 0.254: JSERVOOUT.14 7.24,12.89 7.24,15.02 6.37,15.89 5.82,15.89 4.94,16.77 4.94,20.51 5.85,21.43 6.36,21.43 7.47,22.54 22.27,22.54 22.91,21.91 28.84,21.91 33.92,16.83 37.67,16.83 41.48,13.02 IC5.15 44.88,13.02 45.92,11.98 55.68,11.98 56.72,13.02 IC3.15
N$23
  Top 0.254: IC3.14 56.72,10.48 55.68,9.44 45.92,9.44 44.88,10.48 IC5.14
  Bottom 0.254: IC5.14 41.48,10.48 37.89,6.89 34.46,6.89 33.51,7.83 33.51,12.18 28.86,16.83 27.01,16.83 25.61,18.22 25.61,20.32 9.51,36.42 8.58,36.42 7.21,35.05 7.21,18.41 JSERVOOUT.16
N$24
  Top 0.254: JSERVOOUT.17 21.01,20.04 21.48,19.58 28.61,19.58 33.9,14.29 36.48,14.29 41.48,9.28 41.48,8.57 42.11,7.94 IC5.13
  Bottom 0.254: IC3.13 56.72,7.94 55.68,6.9 45.92,6.9 44.88,7.94 IC5.13
N$34
  Top 0.254: JSERVOOUT.15 4.39,16.19 4.39,25.53 5.6,26.74 6.85,26.74 7.79,25.8 9.84,25.8 13.03,28.99 16.17,28.99 17.84,27.32 43.73,27.32 44.89,26.15 44.89,22.36 44.66,22.13 | IC2.2 79.58,23.18 75.54,19.14 70.45,19.14 68.19,16.88 65.21,16.88 62.81,14.48 49.72,14.48 48.88,15.31 48.88,17.59 44.66,21.81 44.66,22.13 | 44.66,22.13 38.31,22.13 37.26,23.18 IC4.2
N$38
  Top 0.254: IC2.11 71.96,2.86 69.89,0.79 31.71,0.79 29.64,2.86 IC4.11
  Bottom 0.254: IC4.11 26.24,2.86 24.19,4.9 15.56,4.9 10.14,10.32 JSERVOOUT.1
RPM_PWM
  Bottom 0.254: IC6.15 71.12,37.35 70.48,36.72 69.78,36.72 64.98,31.91 64.98,27.6 59.28,21.91 57.53,21.91 56.2,20.58 56.2,18.83 51.66,14.29 49.91,14.29 49.09,13.47 49.09,12.19 IC5.7
RX
  Top 0.254: IC1A.2 70.38,71.44 70.69,71.74 70.69,73.34 71.32,73.98 IC1B.2
  Bottom 0.254: IC1B.2 74.09,73.98 74.93,74.82 JSERIAL.P$3
SADDR  (via drill 0.3 pad 0.61)
  Top 0.254: v75.65,44.83 76.98,44.83 78.31,43.5 IC1B.15
  Bottom 0.254: v75.65,44.83 71.37,44.83 70.38,45.81 70.16,46.04 IC1A.12 66.16,48.46 66.16,52.87 62.16,56.86 62.16,64.31 55.04,71.44 IC11.12
SCK
  Top 0.254: IC7.3 30.05,76.52 29.62,76.09 19.89,76.09 JBUS_CTRL.7 | IC9.9 27.1,46.04 28.14,47.08 36.32,47.08 37.36,46.04 37.67,46.04 IC8.9 41.07,46.04 42.11,45 50.6,45 51.64,46.04 IC10.9
  Bottom 0.254: JBUS_DRO.7 16.29,82.65 32.84,82.65 33.45,82.04 33.45,81.16 32.63,80.33 30.88,80.33 30.05,79.5 30.05,77.15 30.68,76.52 IC7.3 33.45,76.52 36.95,73.02 36.95,48.41 37.67,47.69 37.67,46.67 38.3,46.04 IC8.9 | IC6.19 60.96,40.12 55.04,46.04 IC10.9
SCK_INT
  Top 0.254: IC7.2 33.45,79.06 34.49,78.02 46.45,78.02 51.64,72.83 51.64,69.53 52.27,68.9 IC11.11 | IC1A.16 IC1B.19
  Bottom 0.254: IC1B.19 78.94,53.66 78.31,53.02 78.31,46.51 74.2,42.4 69.95,42.4 64.92,47.44 64.92,53.24 55.04,63.11 55.04,68.26 54.41,68.9 IC11.11
SPINDLE  (via drill 0.3 pad 0.61)
  Top 0.254: v63.29,28 75.11,28 76.2,29.1 IC6.8
  Bottom 0.254: IC4.9 38.41,5.4 42,8.99 43.84,8.99 47.57,12.73 47.57,14.77 49.66,16.85 51.78,16.85 55.7,20.76 55.7,22.63 57.73,24.66 59.95,24.66 v63.29,28
TX
  Bottom 0.254: IC1B.3 71.32,71.44 70.69,72.07 70.69,73.67 70.38,73.98 | IC1A.1 70.38,73.98 | JSERIAL.P$2 70.38,78.32 70.38,73.98
USB_LED
  Top 0.254: IC6.3 63.5,31.86 62.87,32.5 57.76,32.5 54.38,35.88 R2.2
VCC
  Top 0.254: IC8.1 33.45,58.74 34.49,57.7 42.98,57.7 44.02,58.74 IC10.1 46.79,58.74 47.42,59.37 47.42,62.14 51.64,66.36 IC11.10 55.04,66.36 56.15,67.46 | IC4.20 29.64,25.72 30.68,26.76 40.44,26.76 41.48,25.72 IC5.20 | IC2.20 71.96,25.72 70.36,27.32 61.72,27.32 60.12,25.72 IC3.20 | 56.15,67.46 73.49,67.46 74.09,66.86 | 56.15,67.46 56.15,80.49 55.04,81.6 IC11.16 51.64,81.6 50.6,82.64 42.11,82.64 41.07,81.6 IC7.14 | IC1A.21 82.24,66.36 82.02,66.58 81.15,67.45 74.68,67.45 74.09,66.86 | IC1B.7 73.46,61.28 74.09,61.91 74.09,66.86 | 23.29,62.55 R3.2 | 23.29,62.55 19.48,58.74 IC9.1 | 23.29,62.55 21.59,64.25 JBUS_CTRL.2
  Bottom 0.254: IC10.1 47.42,58.74 48.95,57.21 48.95,48.27 52.45,44.77 54.2,44.77 58.42,40.55 IC6.20 58.42,36.72 59.46,35.67 59.46,26.81 58.85,26.15 58.85,25.72 IC3.20 56.72,25.72 55.68,26.76 45.92,26.76 44.88,25.72 IC5.20 | 89.34,67.42 90.4,66.36 C2.2 | 89.34,67.42 86.68,67.42 85.62,66.36 IC1A.21 | JPOWER.2 90.17,68.25 89.34,67.42 | JBUS_CTRL.2 22.91,68.95 22.91,71.23 21.59,72.56 21.59,76.47 JBUS_DRO.2 | IC1B.7 73.46,61.28 74.09,60.64 74.09,60.41 78.31,56.2 IC1B.20 | R3.2 30.48,61.51 30.05,61.07 30.05,59.37 30.68,58.74 IC8.1
WDT_LPT
  Bottom 0.254: 84.03,33.78 83.06,32.8 83.06,25.32 82.19,24.45 80.36,24.45 77.74,21.83 77.74,20 74.38,16.64 71.37,16.64 67.74,13.02 IC3.6 | 84.03,33.78 84.03,33.96 81.28,36.72 IC6.11 | 84.03,33.78 90.47,33.78 91.76,32.48 91.76,18.54 JPCIN.16
WDT_PWM
  Bottom 0.254: IC5.6 51.87,13.02 52.5,13.65 52.5,14.31 57.74,19.55 59.49,19.55 61.74,21.8 61.74,23.6 67.49,29.35 67.49,31.89 72.32,36.72 73.03,36.72 73.66,37.35 IC6.14
X_DIR
  Bottom 0.254: IC4.8 37.26,7.94 37.79,8.47 37.79,15.47 36.43,16.83 34.68,16.83 33.26,18.25 33.26,39.91 33.98,40.63 33.98,53.13 33.45,53.66 IC8.3
X_DIR_DRO
  Top 0.254: IC4.12 29.64,5.4 32.15,5.4 33.6,3.95 38.58,3.95 41.23,1.3 67.86,1.3 71.96,5.4 IC2.12 | JDRO.3 16.46,15.56 13.99,13.09 JSERVOOUT.2
  Bottom 0.254: JSERVOOUT.2 16.69,5.41 26.23,5.41 26.24,5.4 IC4.12
X_STEP
  Bottom 0.254: IC4.7 36.63,10.48 37.26,11.11 37.26,13.46 36.43,14.29 34.7,14.29 32.11,16.87 32.11,26.89 16.08,42.93 16.08,46.54 16.65,47.12 19.33,47.12 24.04,42.41 32.84,42.41 33.45,43.02 33.45,45.4 32.82,46.04 IC8.6
X_STEP_DRO
  Top 0.254: JDRO.1 16.46,18.1 14.22,15.86 JSERVOOUT.3
  Bottom 0.254: IC2.13 72.59,7.94 71.96,7.3 71.96,5.91 66.83,0.78 34.69,0.78 27.78,7.69 27.78,7.94 | IC4.13 27.78,7.94 | 27.78,7.94 27.56,7.94 26.24,7.94 24.39,6.09 16.98,6.09 13.06,10.01 13.06,11.81 JSERVOOUT.3
XTAL1
  Top 0.254: Q1.1 65.74,54.75 71.3,54.75 IC1B.10
  Bottom 0.254: Q1.1 C4.1
XTAL2
  Top 0.254: IC1B.9 70.69,56.2 70.69,56.36 69.7,57.34 Q1.2
  Bottom 0.254: Q1.2 C3.2
Y_DIR
  Bottom 0.254: IC4.6 33.86,13.02 31.33,15.54 31.33,26.96 15.57,42.72 15.57,53.15 16.08,53.66 IC9.3
Y_DIR_DRO
  Bottom 0.254: 27.56,10.48 33.76,4.27 33.76,2.48 34.93,1.31 66.64,1.31 71.4,6.08 71.4,8.22 IC2.14 | 27.56,10.48 26.24,10.48 22.36,6.6 17.19,6.6 16.44,7.35 16.44,10.08 16.83,10.48 | IC4.14 27.56,10.48 | JSERVOOUT.4 16.83,10.81 16.83,10.48 | 16.83,10.48 17.12,10.48 JDRO.7
Y_STEP
  Bottom 0.254: IC4.5 35.23,15.56 32.62,18.17 32.62,27.84 19.48,40.98 19.48,45.4 18.85,46.04 IC9.6
Y_STEP_DRO  (via drill 0.3 pad 0.61)
  Top 0.254: JSERVOOUT.5 22.36,21.4 v23.4,20.35
  Bottom 0.254: JDRO.5 16.46,13.02 16.46,13.95 JSERVOOUT.5 | IC2.15 73.28,13.02 69.27,9 69.27,8.74 66.96,6.44 63.38,6.44 61.29,4.34 34.44,4.34 29.64,9.15 29.64,13.02 IC4.15 26.24,13.02 23.4,15.86 v23.4,20.35
Z_DIR
  Bottom 0.254: IC10.3 44.65,53.66 44.02,53.02 44.02,51.96 41.57,49.51 41.57,42.46 37.8,38.68 37.8,31.09 33.84,27.14 33.84,19.82 IC4.4
Z_DIR_DRO
  Top 0.254: JDRO.4 IC4.16 29.64,15.56 33.45,11.75 36.44,11.75 41.31,6.88 59.59,6.88 64.45,11.75 68.15,11.75 71.96,15.56 IC2.16
  Bottom 0.254: JSERVOOUT.6 16.14,24.17 21.65,18.66 21.65,16.89 JDRO.4
Z_STEP
  Bottom 0.254: IC10.6 44.65,46.04 44.02,45.4 44.02,44.04 41.08,41.1 41.08,24.45 37.26,20.64 IC4.3
Z_STEP_DRO  (via drill 0.3 pad 0.61)
  Top 0.254: v70.31,24.62 68.11,26.81 63.21,26.81 61.07,24.67 49.57,24.67 44.77,29.47 31.57,29.47 25.98,35.07 v22.25,35.07 | IC4.17 27.56,18.1 26.24,18.1 21.64,18.1 JDRO.2
  Bottom 0.254: IC4.17 26.24,19.8 26.24,31.08 v22.25,35.07 | IC2.17 71.96,18.1 70.31,19.74 v70.31,24.62 | JSERVOOUT.7 7.84,25.77 7.84,23.71 8.77,22.78 15.63,22.78 JDRO.2

### Text on the board
Top: TOPC
Bottom: BOTC | 20121119
tPlace: + | - | DRO | TOPS | CTL | CNC-CP-MSB-20121119 | OSHW | (C) 2012 Radu - Eosif Mihailescu
bPlace: BOTS